# Altium schematic sheet DE-110817_01.SchDoc: CuC & Com
size A3; Author: eldar6776@hotmail.com; DrawnBy: Eldar Dedic; Organization: I-MEDIA GROUP d.o.o.; Address1: Topal Osman Paše 18; Address2: 71000 Sarajevo; Address3: Federacija BiH; Address4: Bosna i Hercegovina; DocumentNumber: DE-110817; Revision: 001
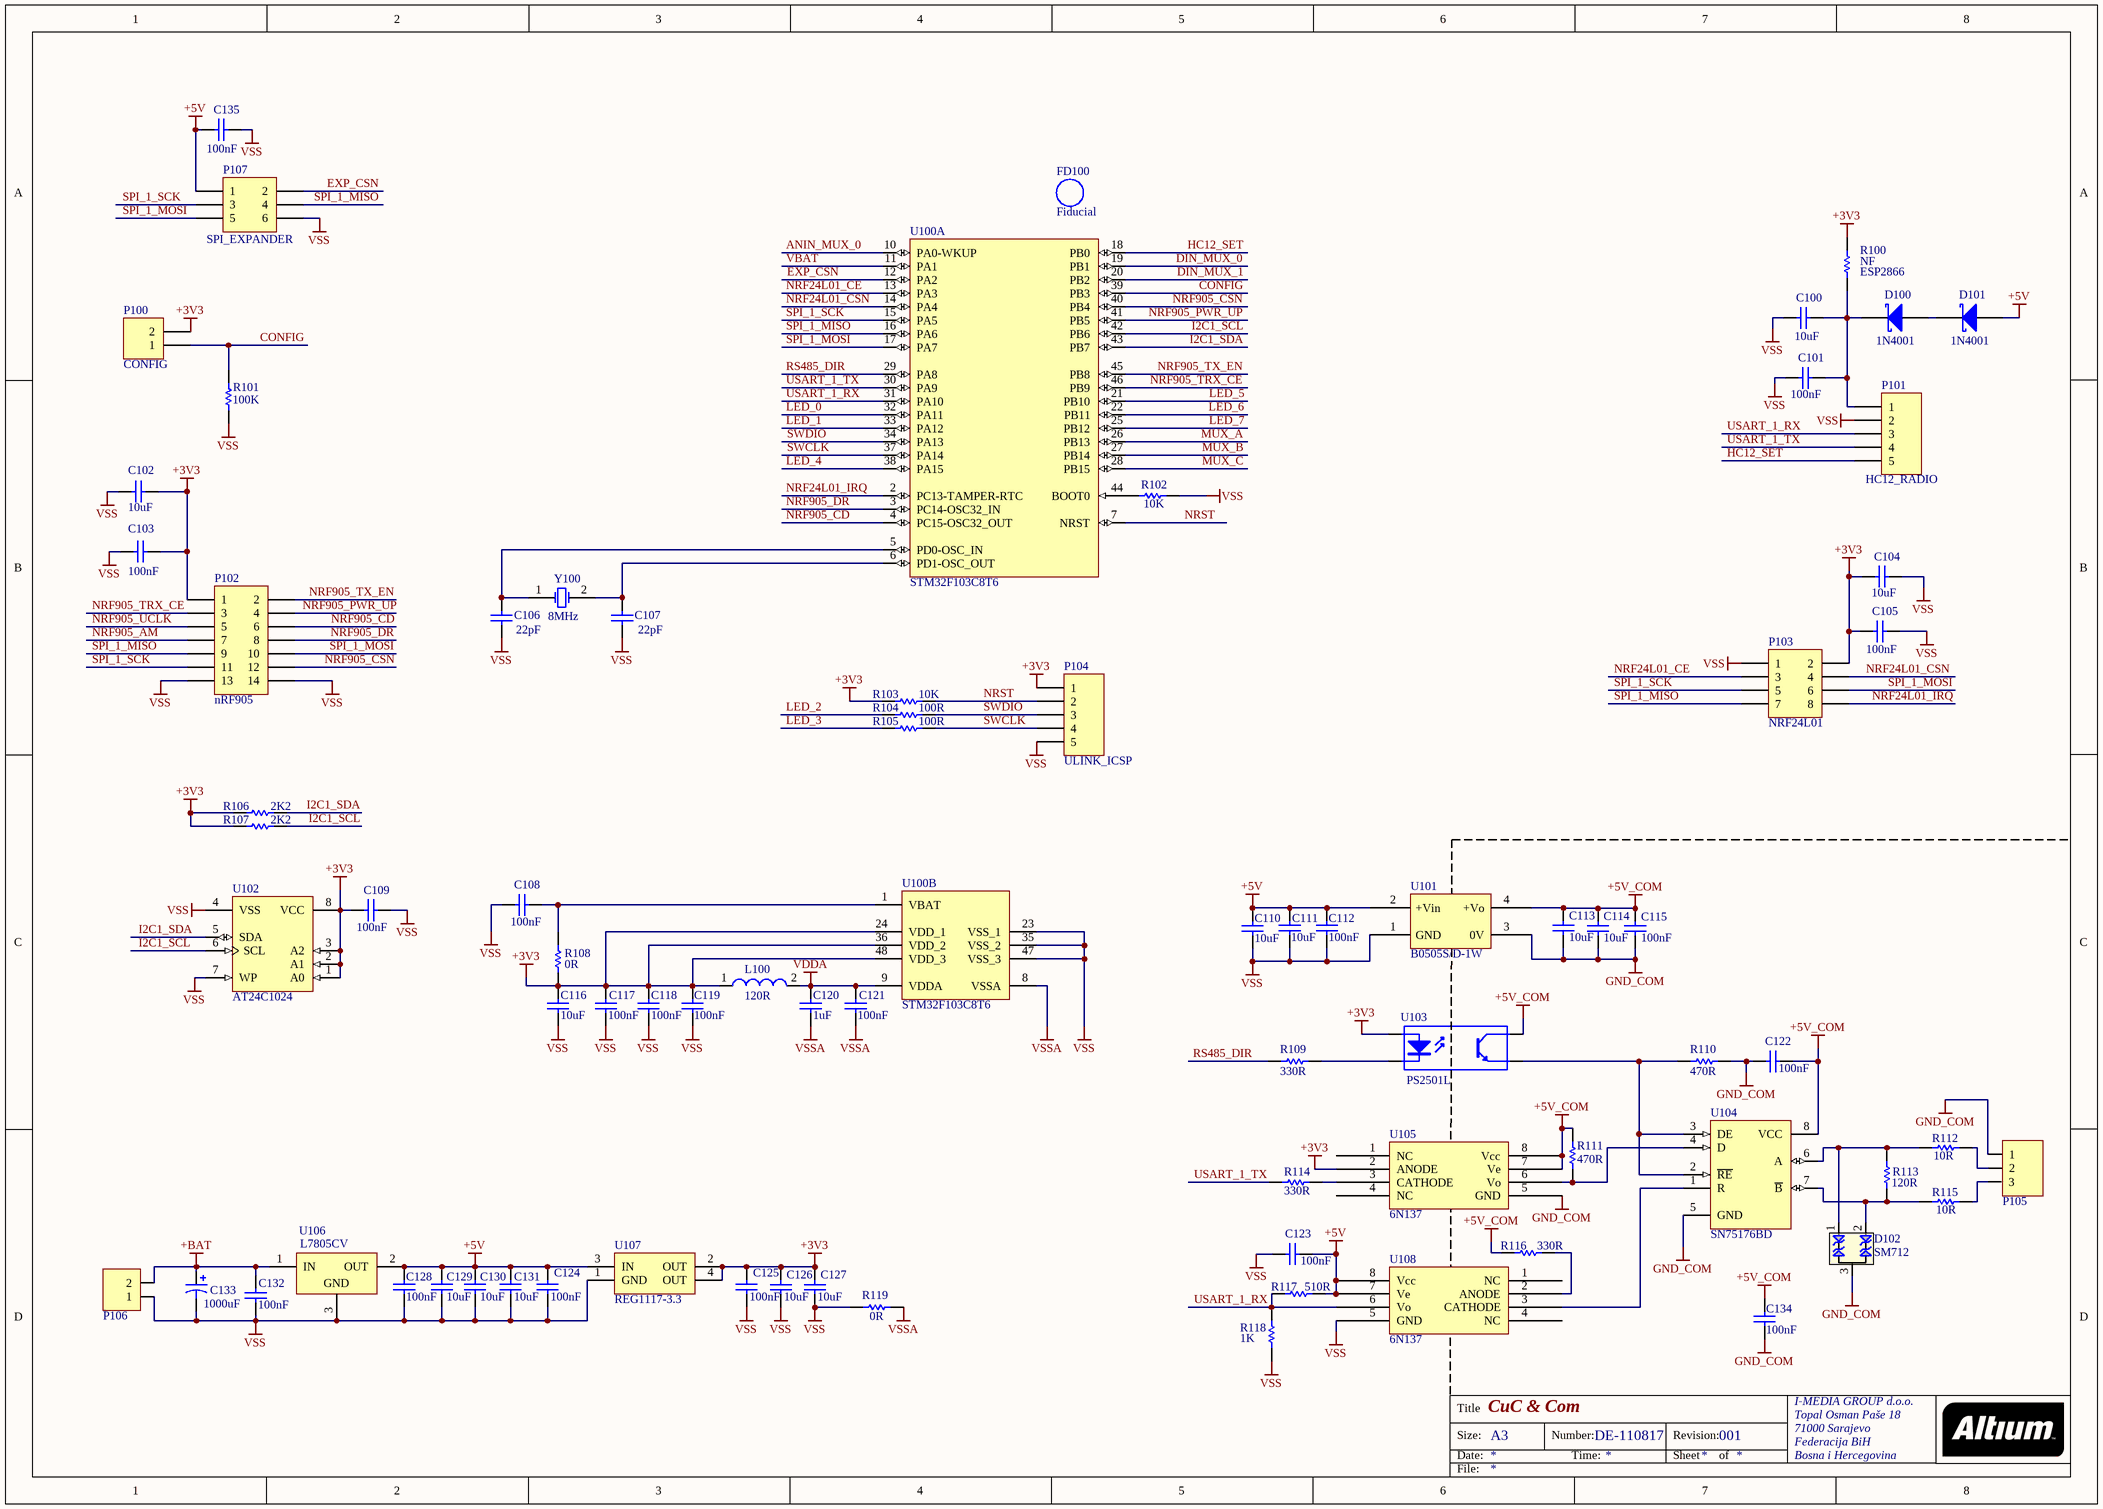
[diagram p0: DE-110817_01.SchDoc]

## Parts
C100  10uF  [0805]
C101  100nF  [0603]
C102  10uF  [0805]
C103  100nF  [0603]
C104  10uF  [0805]
C105  100nF  [0603]
C106  22pF  [0603]
C107  22pF  [0603]
C108  100nF  [0603]
C109  100nF  [0603]
C110  10uF  [0805]
C111  10uF  [0805]
C112  100nF  [0603]
C113  10uF  [0805]
C114  10uF  [0805]
C115  100nF  [0603]
C116  10uF  [0805]
C117  100nF  [0603]
C118  100nF  [0603]
C119  100nF  [0603]
C120  1uF  [0603]
C121  100nF  [0603]
C122  100nF  [0603]
C123  100nF  [0603]
C124  100nF  [0603]
C125  100nF  [0603]
C126  10uF  [0805]
C127  10uF  [0805]
C128  100nF  [0603]
C129  10uF  [0805]
C130  10uF  [0805]
C131  10uF  [0805]
C132  100nF  [0603]
C133  1000uF  [CAPPR5-10x16]
C134  100nF  [0603]
C135  100nF  [0603]
D100  1N4001  [SMA]
D101  1N4001  [SMA]
D102  SM712  [SOT23_3L]
FD100  Fiducial  [Fiducial]  (no BOM)
L100  120R  [SMD-0805]
P100  CONFIG  [HDR1X2]
P101  HC12_RADIO  [HDR1X5]
P102  nRF905  [HDR2X7]
P103  NRF24L01  [HDR2X4]
P104  ULINK_ICSP  [HDR1X5]
P105  TERMINAL BLOK 3  [TERMINAL BLOK 3]  (value not drawn)
P106  TERMINAL BLOK 2  [TERMINAL BLOK 2]  (value not drawn)
P107  SPI_EXPANDER  [HDR2X3]
R100  NF  [ERA-0603]
R101  100K  [ERA-0603]
R102  10K  [ERA-0603]
R103  10K  [ERA-0603]
R104  100R  [ERA-0603]
R105  100R  [ERA-0603]
R106  2K2  [ERA-0603]
R107  2K2  [ERA-0603]
R108  0R  [ERA-0603]
R109  330R  [ERA-0603]
R110  470R  [ERA-0603]
R111  470R  [ERA-0603]
R112  10R  [ERA-0805]
R113  120R  [ERA-0805]
R114  330R  [ERA-0603]
R115  10R  [ERA-0805]
R116  330R  [ERA-0603]
R117  510R  [ERA-0603]
R118  1K  [ERA-0603]
R119  0R  [ERA-0603]
U100  STM32F103C8T6  [STM-LQFP48_N]  (parts A,B of 2)
U101  B0505S/D-1W  [B0505S-1W]
U102  AT24C1024  [SOIC-SN8_N]
U103  PS2501L  [SOP4]
U104  SN75176BD  [D008_L]
U105  6N137  [SMD-8]
U106  L7805CV  [TO220ABN]
U107  REG1117-3.3  [ZZ311]
U108  6N137  [SMD-8]
Y100  8MHz  [HC49/4H_SMX]

## Nets
+3V3: C102.1 C103.1 C104.1 C105.1 C109.1 C116.2 C117.2 C118.2 C119.2 C125.2 C126.2 C127.2 L100.1 P100.2 P102.1 P103.2 P104.1 R100.2 R103.2 R106.1 R107.1 R108.2 U100.24(VDD_1) U100.36(VDD_2) U100.48(VDD_3) U102.1(A0) U102.2(A1) U102.3(A2) U102.8(VCC) U103.1(A) U105.2(ANODE) U107.2(OUT) U107.4(OUT)
+5V: C110.2 C111.2 C112.2 C123.1 C124.2 C128.2 C129.2 C130.2 C131.2 C135.2 D101.1(A) P107.1 R117.1 U101.2(+Vin) U106.2(OUT) U107.3(IN) U108.7(Ve) U108.8(Vcc)
+5V_COM: C113.2 C114.2 C115.2 C122.2 C134.1 R111.1 R116.2 U101.4(+Vo) U103.4(C) U104.8(VCC) U105.7(Ve) U105.8(Vcc)
+BAT: C132.2 C133.1 P106.2 U106.1(IN)
GND_COM: C113.1 C114.1 C115.1 C122.1 C134.2 D102.3(GND) P105.1 R110.2 U101.3(0V) U104.5(GND) U105.5(GND)
VDDA: C120.2 C121.2 L100.2 U100.9(VDDA)
VSS: C100.2 C101.2 C102.2 C103.2 C104.2 C105.2 C106.1 C107.1 C108.2 C109.2 C110.1 C111.1 C112.1 C116.1 C117.1 C118.1 C119.1 C123.2 C124.1 C125.1 C126.1 C127.1 C128.1 C129.1 C130.1 C131.1 C132.1 C133.2 C135.1 P101.2 P102.13 P102.14 P103.1 P104.5 P106.1 P107.6 R101.1 R102.2 R118.1 R119.1 U100.23(VSS_1) U100.35(VSS_2) U100.47(VSS_3) U101.1(GND) U102.4(VSS) U102.7(WP) U106.3(GND) U107.1(GND) U108.5(GND)
VSSA: C120.1 C121.1 R119.2 U100.8(VSSA)
ANIN_MUX_0: U100.10(PA0-WKUP)
CONFIG: P100.1 R101.2 U100.39(PB3)
DIN_MUX_0: U100.19(PB1)
DIN_MUX_1: U100.20(PB2)
EXP_CSN: P107.2 U100.12(PA2)
HC12_SET: P101.5 U100.18(PB0)
I2C1_SCL: R107.2 U100.42(PB6) U102.6(SCL)
I2C1_SDA: R106.2 U100.43(PB7) U102.5(SDA)
LED_0: U100.32(PA11)
LED_1: U100.33(PA12)
LED_2: R104.2
LED_3: R105.2
LED_4: U100.38(PA15)
LED_5: U100.21(PB10)
LED_6: U100.22(PB11)
LED_7: U100.25(PB12)
MUX_A: U100.26(PB13)
MUX_B: U100.27(PB14)
MUX_C: U100.28(PB15)
NRF24L01_CE: P103.3 U100.13(PA3)
NRF24L01_CSN: P103.4 U100.14(PA4)
NRF24L01_IRQ: P103.8 U100.2(PC13-TAMPER-RTC)
NRF905_AM: P102.7
NRF905_CD: P102.6 U100.4(PC15-OSC32_OUT)
NRF905_CSN: P102.12 U100.40(PB4)
NRF905_DR: P102.8 U100.3(PC14-OSC32_IN)
NRF905_PWR_UP: P102.4 U100.41(PB5)
NRF905_TRX_CE: P102.3 U100.46(PB9)
NRF905_TX_EN: P102.2 U100.45(PB8)
NRF905_UCLK: P102.5
NRST: P104.2 R103.1 U100.7(NRST)
RS485_DIR: R109.2 U100.29(PA8)
SPI_1_MISO: P102.9 P103.7 P107.4 U100.16(PA6)
SPI_1_MOSI: P102.10 P103.6 P107.5 U100.17(PA7)
SPI_1_SCK: P102.11 P103.5 P107.3 U100.15(PA5)
SWCLK: P104.4 R105.1 U100.37(PA14)
SWDIO: P104.3 R104.1 U100.34(PA13)
USART_1_RX: P101.3 R117.2 R118.2 U100.31(PA10) U108.6(Vo)
USART_1_TX: P101.4 R114.1 U100.30(PA9)
VBAT: U100.11(PA1)
NetC100_1: C100.1 C101.1 D100.2(K) P101.1 R100.1
NetC106_2: C106.2 U100.5(PD0-OSC_IN) Y100.1(OSC1)
NetC107_2: C107.2 U100.6(PD1-OSC_OUT) Y100.2(OSC2)
NetC108_1: C108.1 R108.1 U100.1(VBAT)
NetD100_1: D100.1(A) D101.2(K)
NetD102_1: D102.1(I/O) R112.1 R113.2 U104.6(A)
NetD102_2: D102.2(I/O) R113.1 R115.1 U104.7(~{B})
NetP105_2: P105.2 R112.2
NetP105_3: P105.3 R115.2
NetR102_1: R102.1 U100.44(BOOT0)
NetR109_1: R109.1 U103.2(K)
NetR110_1: R110.1 U103.3(E) U104.2(~{RE}) U104.3(DE)
NetR111_2: R111.2 U104.4(D) U105.6(Vo)
NetR114_2: R114.2 U105.3(CATHODE)
NetR116_1: R116.1 U108.2(ANODE)
NetU104_1: U104.1(R) U108.3(CATHODE)

Not connected (* = marked no-connect by the designer): U105 1(NC) 4(NC); U108 1(NC) 4(NC)

## Notes on the sheet
- (near R100) ESP2866
- Title
- Size:
- Date:
- A3
- Number:
- Time:
- Revision:
- Sheet
- of
- File:

## Library data of the parts
C100 C102 C104 C110 C111 C113 C114 C116 C126 C127 C129-C131 = C0805: Ceramic Chip Capacitor - Standard; Note: Footprint corresponds to dimensions for bulk cassette packaging. This case size has tightened tolerances.; Published: 17-Jul-2002; LatestRevisionDate: 19-Mar-2004; LatestRevisionNote: Silkscreen size reduced.; DatasheetDocument: Mar-2001; PackageDocument: Mar-2001; PackageReference: 0805; Publisher: Altium Limited; Code_JEITA: 0805; Code_IPC: 2012[0805]; ComponentLink1Description: Manufacturer Link; ComponentLink1URL: http://www.kemet.com/; ComponentLink2Description: Datasheet; ComponentLink2URL: http://www.kemet.com/kemet/web/homepage/kechome.nsf/vapubfilesname/F3102TA.pdf/$file/F3102TA.pdf
  C100 C102 C104 C116: Value: 10uF
C101 C103 C105-C109 C112 C115 C117-C125 C128 C132 C134 C135 = C0603: Ceramic Chip Capacitor - Standard; Note: Footprint corresponds to dimensions for bulk cassette packaging. This case size has tightened tolerances.; Published: 17-Jul-2002; LatestRevisionDate: 19-Mar-2004; LatestRevisionNote: Silkscreen size reduced.; DatasheetDocument: Mar-2001; PackageDocument: Mar-2001; PackageReference: 0603; Publisher: Altium Limited; Code_JEITA: 0603; Code_IPC: 1608 [0603]; ComponentLink1Description: Manufacturer Link; ComponentLink1URL: http://www.kemet.com/; ComponentLink2Description: Datasheet; ComponentLink2URL: http://www.kemet.com/kemet/web/homepage/kechome.nsf/vapubfilesname/F3102TA.pdf/$file/F3102TA.pdf
  C101 C103 C105 C108 C109 C117-C119 C121 C132: Value: 100nF
  C106 C107: Value: 22pF
  C120: Value: 1uF
C133 = EKA00DD410D00: Aluminum Electrolytic Capacitor, Radial Style with Long Leads: 1000uF, 16V; Note: Refer to Manufacturer's Data Sheets for other lead formations; DrillSize: Nominal, Rounded To The Nearest 0.1mm; Published: 19-Mar-2004; DatasheetDocument: 20-Feb-2001; PackageReference: CAPPR5-10X16; Publisher: Altium Limited; ComponentLink1Description: Manufacturer Link; ComponentLink1URL: http://www.vishay.com/; ComponentLink2Description: Datasheet; ComponentLink2URL: http://www.vishay.com/docs/25014/eka.pdf; Value: 1000uF
D100 D101 = 10MQ060N: Schottky Rectifier; Published: 17-Sep-2003; DatasheetVersion: May-2002; PackageVersion: revH, May-2002; PackageReference: SMA; Publisher: Altium Limited; PackageDescription: DO-214-AC/SMA; 2 C-Bend Leads; Body 5 x 2.7 mm, inc. leads (LxW); ComponentLink1Description: Manufacturer Link; ComponentLink1URL: http://www.irf.com/; ComponentLink2Description: Datasheet; ComponentLink2URL: http://www.irf.com/product-info/datasheets/data/10MQ060N.pdf
D102 = 824022: TVS Diode WE-TVS-Standard, VRWM=5.0V; Reverse Stand Off Voltage: 5V; PackageReference: SOT23_3L; PartNumber: 824022; ComponentLink1Description: Manufacturer URL; ComponentLink1URL: http://www.we-online.com; ComponentLink2Description: Datasheet; ComponentLink2URL: http://katalog.we-online.de/kataloge/eisos/media/pdf/824022.pdf
FD100 = Fiduchial: Fiduchial mark
L100 = 74279202: SMD EMI Suppression Ferrite Bead WE-CBF, Z = 120 Ohm; Impedance: 120 Ohm; DatasheetVersion: Dec-2005; PackageReference: SMD-0805; PackageDescription: Chip Inductor, 2-Leads, Body 2.0 x 1.2 mm; PartNumber: 74279202; ComponentLink1Description: Manufacturer URL; ComponentLink1URL: http://www.we-online.com; ComponentLink2Description: Datasheet; ComponentLink2URL: http://www.we-online.de/katalog/media/pdf/74279202.pdf
P100 = Header 2: Header, 2-Pin; LatestRevisionDate: 17-Jul-2002; LatestRevisionNote: Re-released for DXP Platform.; Publisher: Altium Limited
P101 P104 = Header 5: Header, 5-Pin; LatestRevisionDate: 17-Jul-2002; LatestRevisionNote: Re-released for DXP Platform.; Publisher: Altium Limited
P102 = Header 7X2: Header, 7-Pin, Dual row; LatestRevisionDate: 17-Jul-2002; LatestRevisionNote: Re-released for DXP Platform.; Publisher: Altium Limited
P103 = Header 4X2: Header, 4-Pin, Dual row; LatestRevisionDate: 17-Jul-2002; LatestRevisionNote: Re-released for DXP Platform.; Publisher: Altium Limited
P105 = TERMINAL BLOK 3: 3 pinski terminal blok konektor
P106 = TERMINAL BLOK 2: 2 pinski terminal blok
P107 = Header 3X2: Header, 3-Pin, Dual row; LatestRevisionDate: 17-Jul-2002; LatestRevisionNote: Re-released for DXP Platform.; Publisher: Altium Limited
R100 R109-R111 R116-R119 = ERAV: Metal Film Thermosensitive Chip Resistor, 0.56 Ohm to 10k Ohm Range, 5% Tolerance, 0603 Size, 0.063 W; Note: If flow soldering, adjust pad width of PCB Footprint to 0.7 - 0.8 times the width of the resistor.; Published: 17-Dec-2003; LatestRevisionDate: 19-Mar-2004; LatestRevisionNote: Silkscreen size reduced.; PackageDocument: Mar-2003; PackageReference: ERA-0603; Publisher: Altium Limited; Code_IPC: 1608 [0603]; ComponentLink1Description: Manufacturer Link; ComponentLink1URL: http://www.panasonic.com/industrial/components/resistive_products.htm; ComponentLink2Description: Datasheet; ComponentLink2URL: http://www.panasonic.com/industrial/components/pdf/AOF0000CE1.pdf
R101-R108 R114 = ERA3Y: Rectangular Thick Film Chip Resistor, 10 Ohm to 330k Ohm Range, 0.1% and 0.5% Tolerance, 0603 Size, 0.063 W; Note: If flow soldering, adjust pad width of PCB Footprint to 0.7 - 0.8 times the width of the resistor.; Published: 17-Dec-2003; LatestRevisionDate: 19-Mar-2004; LatestRevisionNote: Silkscreen size reduced.; PackageDocument: Mar-2003; PackageReference: ERA-0603; Publisher: Altium Limited; Code_IPC: 1608 [0603]; ComponentLink1Description: Manufacturer Link; ComponentLink1URL: http://www.panasonic.com/industrial/components/resistive_products.htm; ComponentLink2Description: Datasheet; ComponentLink2URL: http://www.panasonic.com/industrial/components/pdf/AOA0000CE8.pdf
  R101: Value: 100K
  R102 R103: Value: 10K
  R104 R105: Value: 100R
  R106 R107: Value: 2K2
  R108: Value: 0R
  R114: Value: 330R
R112 R113 R115 = ERA6Y: Rectangular Thick Film Chip Resistor, 10 Ohm to 1M Ohm Range, 0.1% and 0.5% Tolerance, 0805 Size, 0.1 W; Note: If flow soldering, adjust pad width of PCB Footprint to 0.7 - 0.8 times the width of the resistor.; Published: 17-Dec-2003; LatestRevisionDate: 19-Mar-2004; LatestRevisionNote: Silkscreen size reduced.; PackageDocument: Mar-2003; PackageReference: ERA-0805; Publisher: Altium Limited; Code_IPC: 2012 [0805]; ComponentLink1Description: Manufacturer Link; ComponentLink1URL: http://www.panasonic.com/industrial/components/resistive_products.htm; ComponentLink2Description: Datasheet; ComponentLink2URL: http://www.panasonic.com/industrial/components/pdf/AOA0000CE8.pdf
  R112 R115: Value: 10R
  R113: Value: 120R
U100 = STM32F103C8T6: ARM Cortex-M3 32-bit MCU, 64 KB Flash, 20 KB Internal RAM, 37 I/Os, 48-pin LQFP, -40 to 85 degC, Tray; A/D Converter: 2x12-bit (10 Channel); FLASH Size (Prog) (kB): 64; I/Os (High Current): 37; Internal RAM Size (kB): 20; Operating Frequency(F) (Processor speed) (MHz): 72; Supply Voltage(Vcc) min (V): 2; DatasheetVersion: Rev. 16; PackageVersion: Rev. 6, 06/2013; PackageReference: LQFP48; PackageDescription: 48-Pin Low Profile Quad Flat Package, 7 x 7 mm Body, 0.5 mm Pitch; Supplier 1: Digi-Key; Supplier Part Number 1: 497-6063-ND; Supplier 2: Farnell; Supplier Part Number 2: 1447637; Supplier 3: Newark; Supplier Part Number 3: 59M2182; Supplier 4: Newark; Supplier Part Number 4: 57P1222; Supplier 5: Mouser; Supplier Part Number 5: 511-STM32F103C8T6; Core: ARM Cortex-M3; Packing: Tray; Mounting Technology: Surface Mount; PartNumber: STM32F103C8T6; ComponentLink1Description: Manufacturer URL; ComponentLink1URL: http://www.st.com/web/en/home.html; ComponentLink2Description: Datasheet; ComponentLink2URL: http://www.st.com/st-web-ui/static/active/en/resource/technical/document/datasheet/CD00161566.pdf; ComponentLink3Description: Package Specification; ComponentLink3URL: http://www.st.com/st-web-ui/static/active/en/resource/technical/document/datasheet/DM00058181.pdf
U101 = B0505S/D: 1W isolated dc dc converter
U102 = 24AA64/SN: 64Kbit, 400kHz, 1.7V, I2C Serial EEPROM, 8-Pin SOIC 150mil, Commercial Temperature; Published: 29-Jan-2009; DatasheetVersion: revQ, Jun-2009; PackageVersion: revBB, Aug-2009; PackageReference: SOIC-SN8; Publisher: Altium Limited; PackageDescription: 8-Lead Plastic Small Outline (SN) - Narrow, 3.90mm Body [SOIC]; Supplier 1: Digi-Key; Supplier Part Number 1: 24AA64/SN-ND; Code_JEDEC: MS-012; Code_IPC: SOIC127P600-8; ComponentLink1Description: Datasheet; ComponentLink1URL: http://ww1.microchip.com/downloads/en/DeviceDoc/21189Q.pdf; ComponentLink2Description: Packaging Specification; ComponentLink2URL: http://www.microchip.com/stellent/groups/techpub_sg/documents/packagingspec/en012702.pdf; ComponentLink3Description: Microchip.com Home; ComponentLink3URL: http://www.microchip.com/
U103 = PC817 optocoupler: 4-Pin Phototransistor Optocoupler; Published: 24-Mar-1999; LatestRevisionDate: 04-Mar-2005; LatestRevisionNote: Sch pins 3 & 4 Swapped.; DatasheetVersion: Nov-2003; PackageReference: DIP-4; Publisher: Altium Limited
U104 = SN75176BD: Differential Bus Transceiver; Note: Receiver Hysteresis of 50mV Typical; Published: 15-May-2002; LatestRevisionDate: 13-Apr-2006; LatestRevisionNote: IPC-7351 Footprint Added.; DatasheetVersion: Sep-1989; PackageVersion: Jan-1998; PackageReference: D008; Publisher: Altium Limited; PackageDescription: 8-Pin Small Outline Integrated Circuit 1.27 mm Pitch; Code_IPC: SOIC127P600-8; ComponentLink1Description: Manufacturer Link; ComponentLink1URL: http://www.ti.com/; ComponentLink2Description: Datasheet; ComponentLink2URL: http://www-s.ti.com/sc/ds/sn75176b.pdf
U105 U108 = 6N137: High CMR, High Speed TTL Compatibile Optocoupler
U106 = L7805CV: Positive Voltage Regulator; Note: Tab is connected to pin 3 (GND).; Published: 24-Aug-2001; LatestRevisionDate: 17-Jul-2002; LatestRevisionNote: Re-released for DXP Platform.; DatasheetVersion: Dec-1998; PackageVersion: Jun-1998; PackageReference: TO220ABN; Publisher: Altium Limited; PackageDescription: TO, Thru-Hole, Vertical, Heatsink Mounted; 3 In-Line Leads; Pitch 2.54 mm; Pin sequence 1, 3, 2; ComponentLink1Description: Manufacturer Link; ComponentLink1URL: http://www.st.com/
U107 = REG1117-3.3: 800mA and 1A Low Dropout Positive Regulator 2.85V, 3.3V, 5V, and Adjustable; Published: 8-Jun-2000; LatestRevisionDate: 17-Jul-2002; LatestRevisionNote: Re-released for DXP Platform.; DatasheetVersion: Sep-1997; PackageVersion: revC; PackageReference: ZZ311; Publisher: Altium Limited; PackageDescription: SOT-223/SC-73; 4 Leads; Body 6.7 x 7.3 mm, inc. leads (LxW max); ComponentLink1Description: Manufacturer Link; ComponentLink1URL: http://www.ti.com/; ComponentLink2Description: Datasheet; ComponentLink2URL: http://www-s.ti.com/sc/ds/REG1117.pdf
Y100 = HC49/4H_SMX: Surface Mount Quartz Crystal; Note: PCB layout complies with manufacturer's recommendation.; Published: 17-Jul-2002; DatasheetDocument: 18-Oct-1999; PackageDocument: 18-Oct-1999; PackageReference: HC49/4H_SMX; Publisher: Altium Limited; ComponentLink1Description: Manufacturer Link; ComponentLink1URL: http://www.cmac.com/mt/; ComponentLink2Description: Datasheet; ComponentLink2URL: http://www.cmac.com/mt/databook/crystals/smd/hc49_4h_smx.pdf